# Altium schematic sheet EXP.SchDoc
size A4
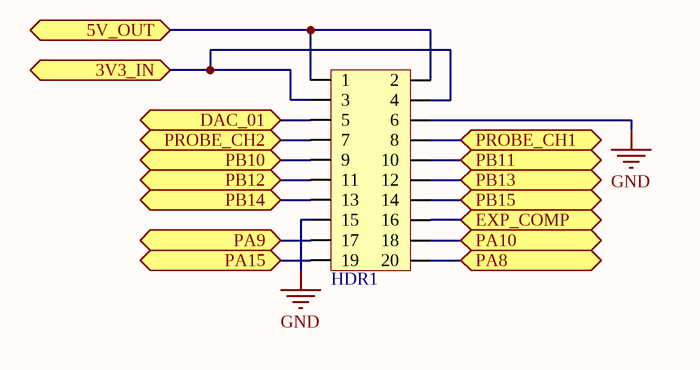
[diagram p0: EXP.SchDoc]

## Parts
HDR1  HDR2x10_2.54  [HDR2X10_2.54_180HF]  (value not drawn)

## Ports
3V3_IN, 5V_OUT, DAC_01, EXP_COMP, PA8, PA9, PA10, PA15, PB10, PB11, PB12, PB13, PB14, PB15, PROBE_CH1, PROBE_CH2

## Nets
GND: HDR1.6 HDR1.15
3V3_IN: HDR1.3 HDR1.4 ; port 3V3_IN
5V_OUT: HDR1.1 HDR1.2 ; port 5V_OUT
DAC_01: HDR1.5 ; port DAC_01
EXP_COMP: HDR1.16 ; port EXP_COMP
PA8: HDR1.20 ; port PA8
PA9: HDR1.17 ; port PA9
PA10: HDR1.18 ; port PA10
PA15: HDR1.19 ; port PA15
PB10: HDR1.9 ; port PB10
PB11: HDR1.10 ; port PB11
PB12: HDR1.11 ; port PB12
PB13: HDR1.12 ; port PB13
PB14: HDR1.13 ; port PB14
PB15: HDR1.14 ; port PB15
PROBE_CH1: HDR1.8 ; port PROBE_CH1
PROBE_CH2: HDR1.7 ; port PROBE_CH2

## Library data of the parts
HDR1 = HDR2x10_2.54: Header